# Altium schematic sheet main1.SchDoc
size A3
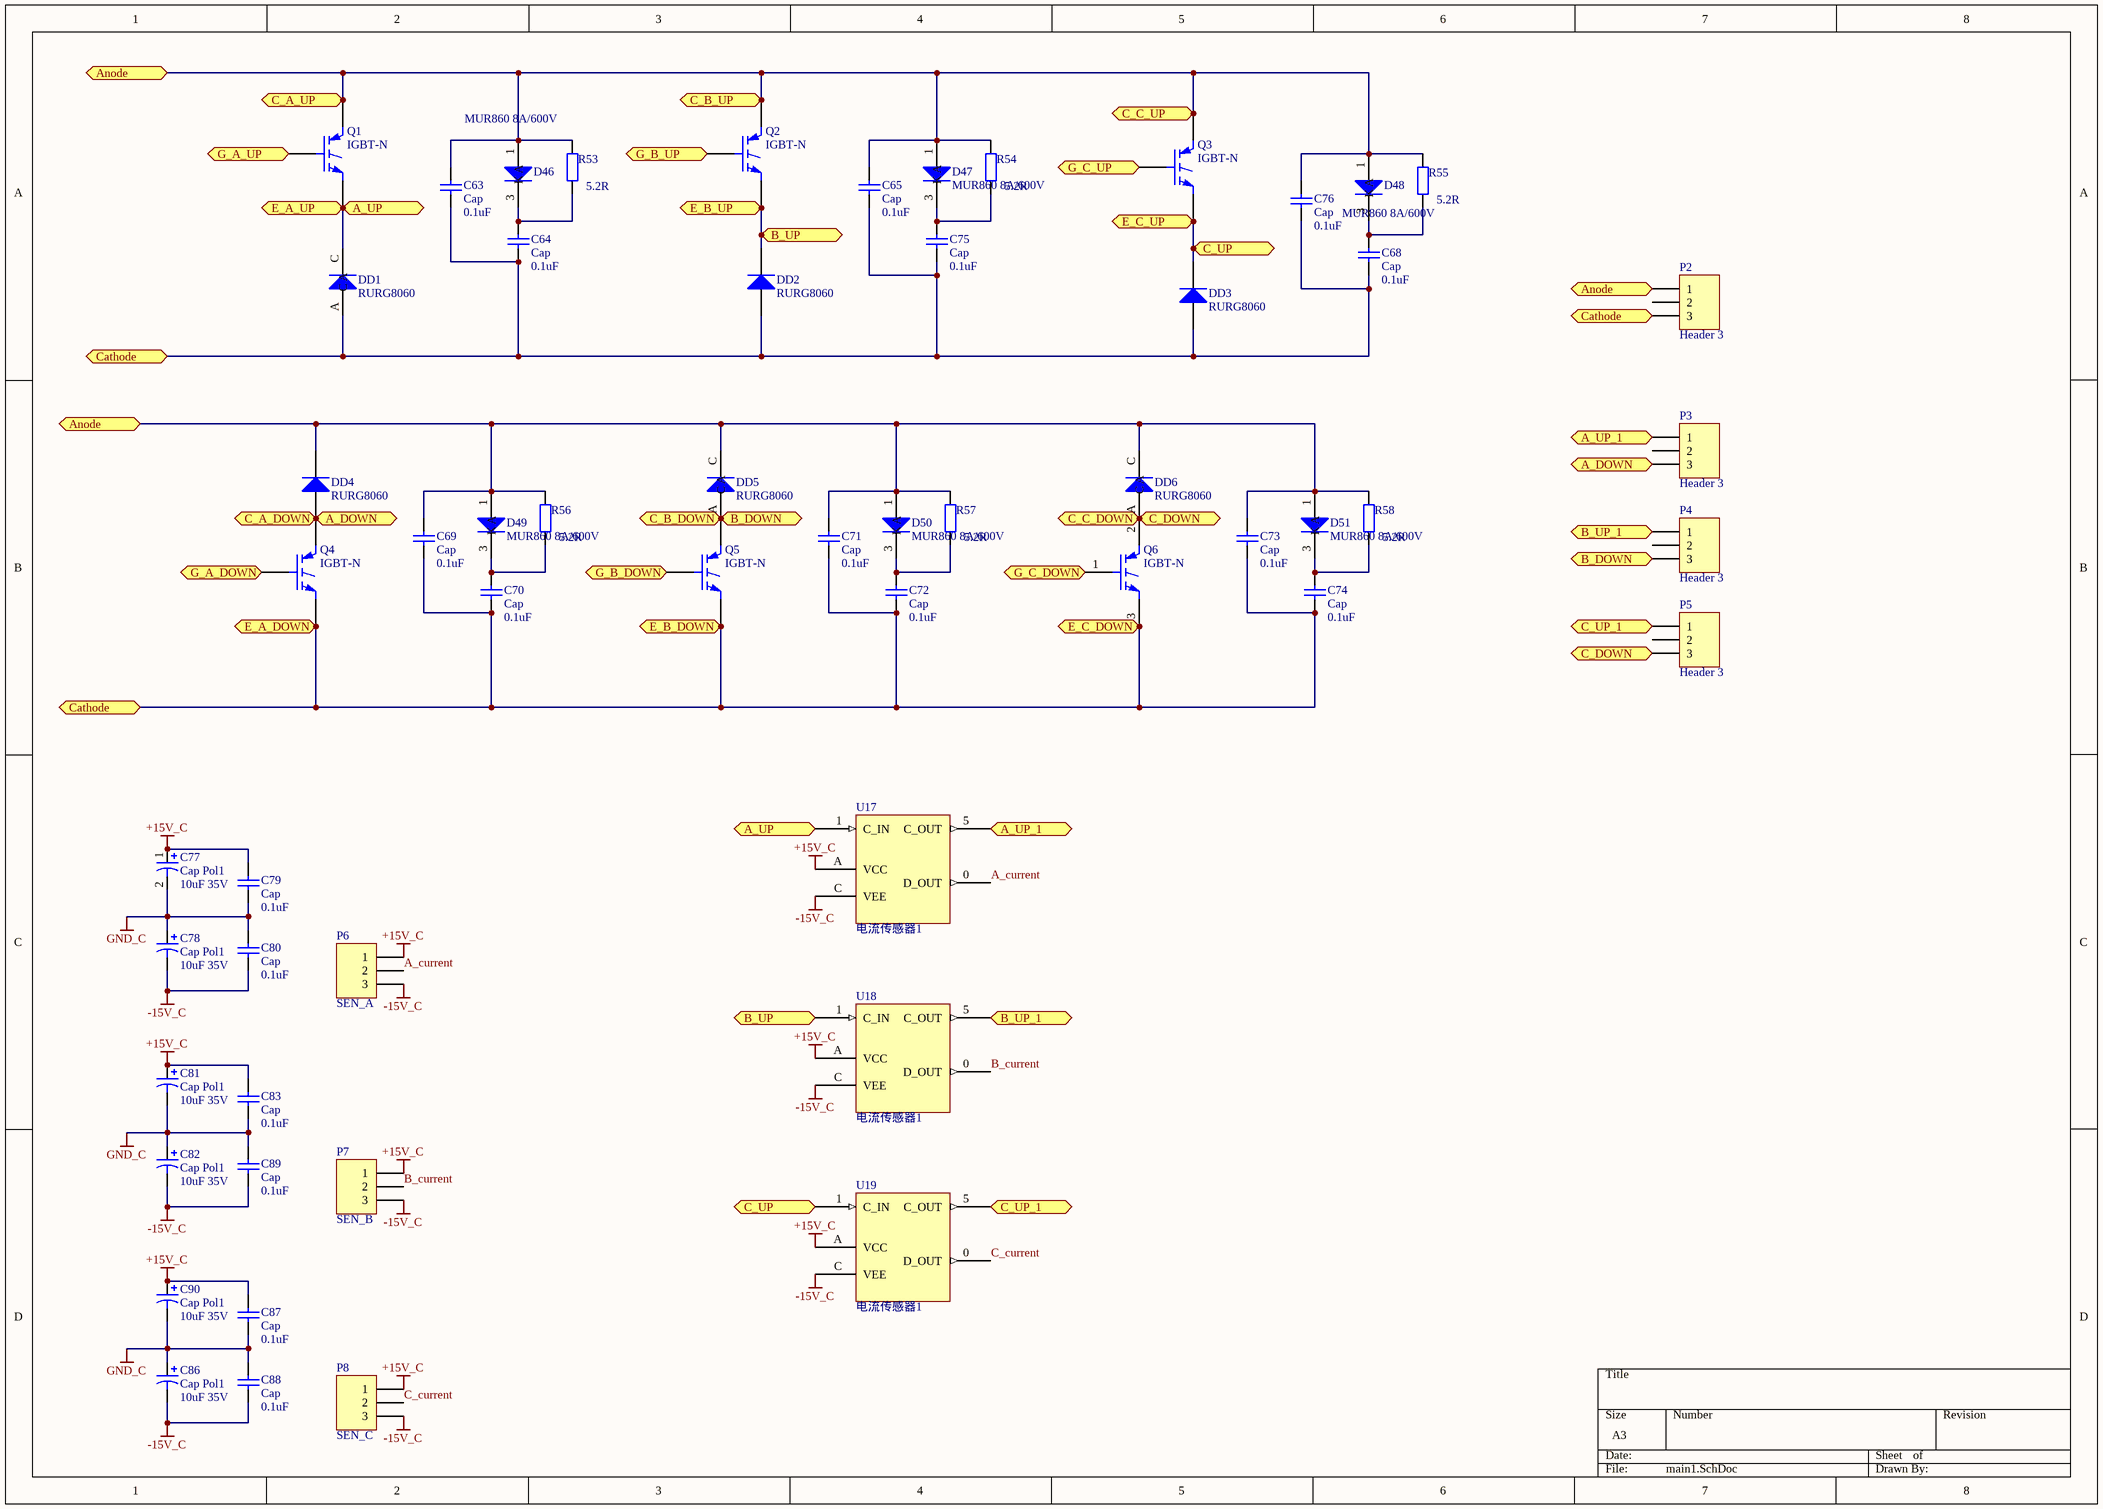
[diagram p0: main1.SchDoc]

## Parts
C63  Cap  value 0.1uF  [无感电容15*6]
C64  Cap  value 0.1uF  [无感电容15*6]
C65  Cap  value 0.1uF  [无感电容15*6]
C68  Cap  value 0.1uF  [无感电容15*6]
C69  Cap  value 0.1uF  [无感电容15*6]
C70  Cap  value 0.1uF  [无感电容15*6]
C71  Cap  value 0.1uF  [无感电容15*6]
C72  Cap  value 0.1uF  [无感电容15*6]
C73  Cap  value 0.1uF  [无感电容15*6]
C74  Cap  value 0.1uF  [无感电容15*6]
C75  Cap  value 0.1uF  [无感电容15*6]
C76  Cap  value 0.1uF  [无感电容15*6]
C77  Cap Pol1  value 10uF 35V  [1206]
C78  Cap Pol1  value 10uF 35V  [1206]
C79  Cap  value 0.1uF  [1206]
C80  Cap  value 0.1uF  [1206]
C81  Cap Pol1  value 10uF 35V  [1206]
C82  Cap Pol1  value 10uF 35V  [1206]
C83  Cap  value 0.1uF  [1206]
C86  Cap Pol1  value 10uF 35V  [1206]
C87  Cap  value 0.1uF  [1206]
C88  Cap  value 0.1uF  [1206]
C89  Cap  value 0.1uF  [1206]
C90  Cap Pol1  value 10uF 35V  [1206]
D46  MUR860 8A/600V  [TO-220_SANRE]
D47  MUR860 8A/600V  [TO-220_SANRE]
D48  MUR860 8A/600V  [TO-220_SANRE]
D49  MUR860 8A/600V  [TO-220_SANRE]
D50  MUR860 8A/600V  [TO-220_SANRE]
D51  MUR860 8A/600V  [TO-220_SANRE]
DD1  RURG8060  [TO247dio]
DD2  RURG8060  [TO247dio]
DD3  RURG8060  [TO247dio]
DD4  RURG8060  [TO247dio]
DD5  RURG8060  [TO247dio]
DD6  RURG8060  [TO247dio]
P2  Header 3  [端子9.5mm-3]
P3  Header 3  [端子9.5mm-3]
P4  Header 3  [端子9.5mm-3]
P5  Header 3  [端子9.5mm-3]
P6  SEN_A  [PHENOX-3]
P7  SEN_B  [PHENOX-3]
P8  SEN_C  [PHENOX-3]
Q1  IGBT-N  [TO247]
Q2  IGBT-N  [TO247]
Q3  IGBT-N  [TO247]
Q4  IGBT-N  [TO247]
Q5  IGBT-N  [TO247]
Q6  IGBT-N  [TO247]
R53  5.2R  [水泥电阻22*9.5]
R54  5.2R  [水泥电阻22*9.5]
R55  5.2R  [水泥电阻22*9.5]
R56  5.2R  [水泥电阻22*9.5]
R57  5.2R  [水泥电阻22*9.5]
R58  5.2R  [水泥电阻22*9.5]
U17  电流传感器1  [电流传感器1]
U18  电流传感器1  [电流传感器1]
U19  电流传感器1  [电流传感器1]

## Ports
A_DOWN, A_UP, A_UP_1, Anode, B_DOWN, B_UP, B_UP_1, C_A_DOWN, C_A_UP, C_B_DOWN, C_B_UP, C_C_DOWN, C_C_UP, C_DOWN, C_UP, C_UP_1, Cathode, E_A_DOWN, E_A_UP, E_B_DOWN, E_B_UP, E_C_DOWN, E_C_UP, G_A_DOWN, G_A_UP, G_B_DOWN, G_B_UP, G_C_DOWN, G_C_UP

## Nets
+15V_C: C77.1 C79.2 C81.1 C83.2 C87.2 C90.1 P6.1 P7.1 P8.1 U17.A(VCC) U18.A(VCC) U19.A(VCC)
-15V_C: C78.2 C80.1 C82.2 C86.2 C88.1 C89.1 P6.3 P7.3 P8.3 U17.C(VEE) U18.C(VEE) U19.C(VEE)
GND_C: C77.2 C78.1 C79.1 C80.2 C81.2 C82.1 C83.1 C86.1 C87.1 C88.2 C89.2 C90.2
A_current: P6.2 U17.0(D_OUT)
A_DOWN: DD4.A P3.3 Q4.2(C) ; port C_A_DOWN, port A_DOWN
A_UP: DD1.C Q1.3(E) U17.1(C_IN) ; port E_A_UP, port A_UP
A_UP_1: P3.1 U17.5(C_OUT) ; port A_UP_1
Anode: C63.2 C65.2 C69.2 C71.2 C73.2 C76.2 D46.1(K) D47.1(K) D48.1(K) D49.1(K) D50.1(K) D51.1(K) DD4.C DD5.C DD6.C P2.1 Q1.2(C) Q2.2(C) Q3.2(C) R53.2 R54.2 R55.2 R56.2 R57.2 R58.2 ; port Anode, port C_A_UP, port C_B_UP, port C_C_UP
B_current: P7.2 U18.0(D_OUT)
B_DOWN: DD5.A P4.3 Q5.2(C) ; port C_B_DOWN, port B_DOWN
B_UP: DD2.C Q2.3(E) U18.1(C_IN) ; port E_B_UP, port B_UP
B_UP_1: P4.1 U18.5(C_OUT) ; port B_UP_1
C_C_DOWN: DD6.A P5.3 Q6.2(C) ; port C_C_DOWN, port C_DOWN
C_current: P8.2 U19.0(D_OUT)
C_UP: DD3.C Q3.3(E) U19.1(C_IN) ; port E_C_UP, port C_UP
C_UP_1: P5.1 U19.5(C_OUT) ; port C_UP_1
Cathode: C63.1 C64.1 C65.1 C68.1 C69.1 C70.1 C71.1 C72.1 C73.1 C74.1 C75.1 C76.1 DD1.A DD2.A DD3.A P2.3 Q4.3(E) Q5.3(E) Q6.3(E) ; port Cathode, port E_A_DOWN, port E_B_DOWN, port E_C_DOWN
G_A_DOWN: Q4.1(G) ; port G_A_DOWN
G_A_UP: Q1.1(G) ; port G_A_UP
G_B_DOWN: Q5.1(G) ; port G_B_DOWN
G_B_UP: Q2.1(G) ; port G_B_UP
G_C_DOWN: Q6.1(G) ; port G_C_DOWN
G_C_UP: Q3.1(G) ; port G_C_UP
NetC64_2: C64.2 D46.3(A) R53.1
NetC68_2: C68.2 D48.3(A) R55.1
NetC70_2: C70.2 D49.3(A) R56.1
NetC72_2: C72.2 D50.3(A) R57.1
NetC74_2: C74.2 D51.3(A) R58.1
NetC75_2: C75.2 D47.3(A) R54.1

Not connected (* = marked no-connect by the designer): P2 2; P3 2; P4 2; P5 2

## Library data of the parts
C63-C65 C68-C76 C79 C80 C83 C87-C89 = Cap: Capacitor; Published: 8-Jun-2000; LatestRevisionDate: 17-Jul-2002; LatestRevisionNote: Re-released for DXP Platform.; PackageReference: RAD-0.3; Publisher: Altium Limited
C77 C78 C81 C82 C86 C90 = Cap Pol1: Polarized Capacitor (Radial); Published: 8-Jun-2000; LatestRevisionDate: 17-Jul-2002; LatestRevisionNote: Re-released for DXP Platform.; PackageReference: RB7.6-15; Publisher: Altium Limited
D46-D51 DD1-DD6 = Diode 1N4148: High Conductance Fast Diode; Published: 8-Jun-2000; LatestRevisionDate: 17-Jul-2002; LatestRevisionNote: Re-released for DXP Platform.; DatasheetVersion: 1997; PackageReference: DO-35; Publisher: Altium Limited; Code_JEDEC: DO-204-AH; ComponentLink1Description: Manufacturer Link; ComponentLink1URL: http://www.fairchildsemi.com/; ComponentLink2Description: Datasheet; ComponentLink2URL: http://www.fairchildsemi.com/ds/1N%2F1N4148.pdf
P2-P8 = Header 3: Header, 3-Pin; LatestRevisionDate: 17-Jul-2002; LatestRevisionNote: Re-released for DXP Platform.; Publisher: Altium Limited
Q1-Q6 = IGBT-N: Insulated Gate Bipolar Transistor (N-Channel); Published: 8-Jun-2000; LatestRevisionDate: 17-Jul-2002; LatestRevisionNote: Re-released for DXP Platform.; DatasheetVersion: PD-9.684A; PackageReference: TO-247; Publisher: Altium Limited; Code_JEDEC: TO-247-AC; ComponentLink1Description: Manufacturer Link; ComponentLink1URL: http://www.irf.com/
R53-R58 = Res2: Resistor; Published: 8-Jun-2000; LatestRevisionDate: 17-Jul-2002; LatestRevisionNote: Re-released for DXP Platform.; PackageReference: AXIAL-0.4; Publisher: Altium Limited; Value: 5.2R